# EAGLE schematic mp28164-buck-boost-flashlight-driver-tester-mk-1.0.1.opamp.only (EAGLE 9.2.2)
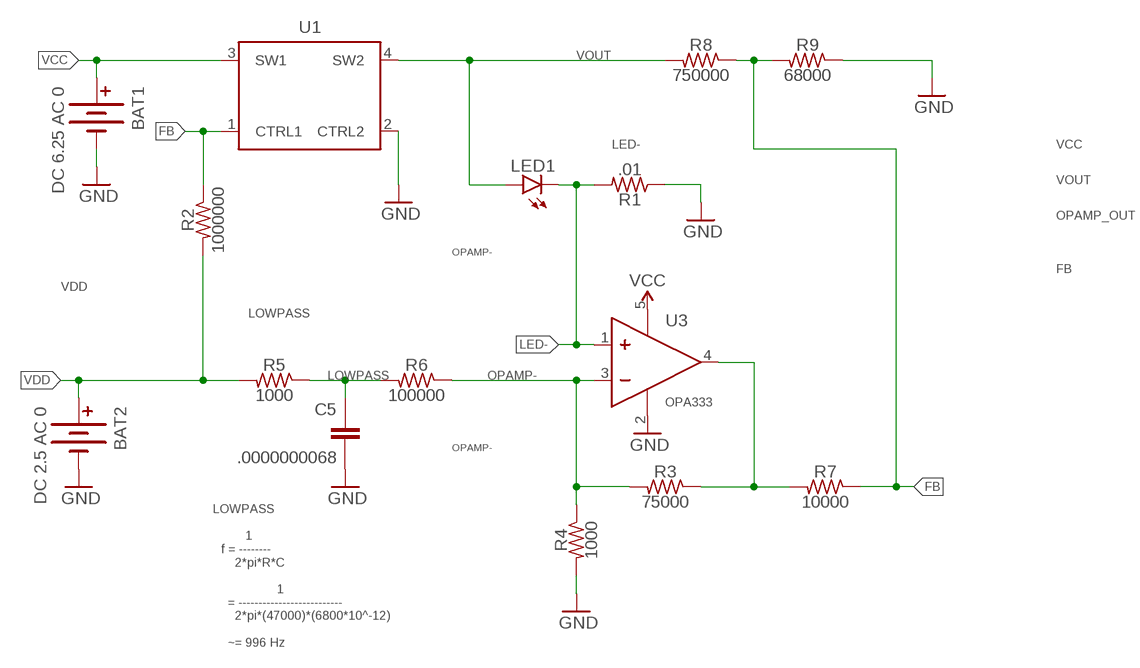
[diagram p0: schematic, sheet 1]

## Parts
BAT1  DC 6.25 AC 0  BATTERY9V  [BATTCON_9V]
BAT2  DC 2.5 AC 0  BATTERY9V  [BATTCON_9V]
C5  .0000000068  CAPACITOR-CERAMICC0402  [C0402]
LED1  LED3MM  [LED3MM]
R1  .01  RESISTORR0805-TIGHTER  [R0805-TIGHTER]
R2  1000000  RESISTORR0402  [R0402]
R3  75000  RESISTORR0402  [R0402]
R4  1000  RESISTORR0402  [R0402]
R5  1000  RESISTORR0402  [R0402]
R6  100000  RESISTORR0402  [R0402]
R7  10000  RESISTORR0402  [R0402]
R8  750000  RESISTORR0402  [R0402]
R9  68000  RESISTORR0402  [R0402]
U1  VSWITCH  [DIL04]
U3  OPA333  OPAMPOPA333-SC-70  [SC70]

## Nets
FB: R2.1 R7.1 R8.1 R9.2 U1.1(CTRL1)
GND: BAT1.- BAT2.- C5.2 R1.1 R4.2 R9.1 U1.2(CTRL2) U3.2(V-)
LED-: LED1.K(C) R1.2 U3.1(IN+)
LOWPASS: C5.1 R5.1 R6.2
OPAMP-: R3.2 R4.1 R6.1 U3.3(IN-)
OPAMP_OUT: R3.1 R7.2 U3.4(OUT)
VCC: BAT1.+ U1.3(SW1) U3.5(V+)
VDD: BAT2.+ R2.2 R5.2
VOUT: LED1.A R8.2 U1.4(SW2)

## Notes on the sheet
- 1
  f = --------
      2*pi*R*C
  
                  1
    = --------------------------
      2*pi*(47000)*(6800*10^-12)
  
    ~= 996 Hz

## Library data of the parts
BAT1 BAT2 = a_parts:BATTERY: Battery Holders Various common sizes : AA, AAA, 20mm coin cell and 12mm coin cell. 20MM_4LEGS, BATT-10373; SPICEPREFIX: V
C5 = a_parts:CAPACITOR-CERAMIC: CAPACITOR, European symbol; SPICEPREFIX: C
LED1 = a_parts:LED: LEDs Standard schematic elements and footprints for 5mm, 3mm, 1206, and 0603 sized LEDs. 5mm - Spark Fun Electronics SKU : COM-00529 (and others); SPICEMODEL: DMOD; SPICEPREFIX: D
R1-R9 = a_parts:RESISTOR: RESISTOR, American symbol; SPICEPREFIX: R
U1 = a_parts:VSWITCH; SPICEMODEL: VSMOD; SPICEPREFIX: S
U3 = a_parts:OPAMP; SPICEMODEL: OPAMP; SPICEPREFIX: X